# Altium schematic sheet ETHERNET.SchDoc
size A3
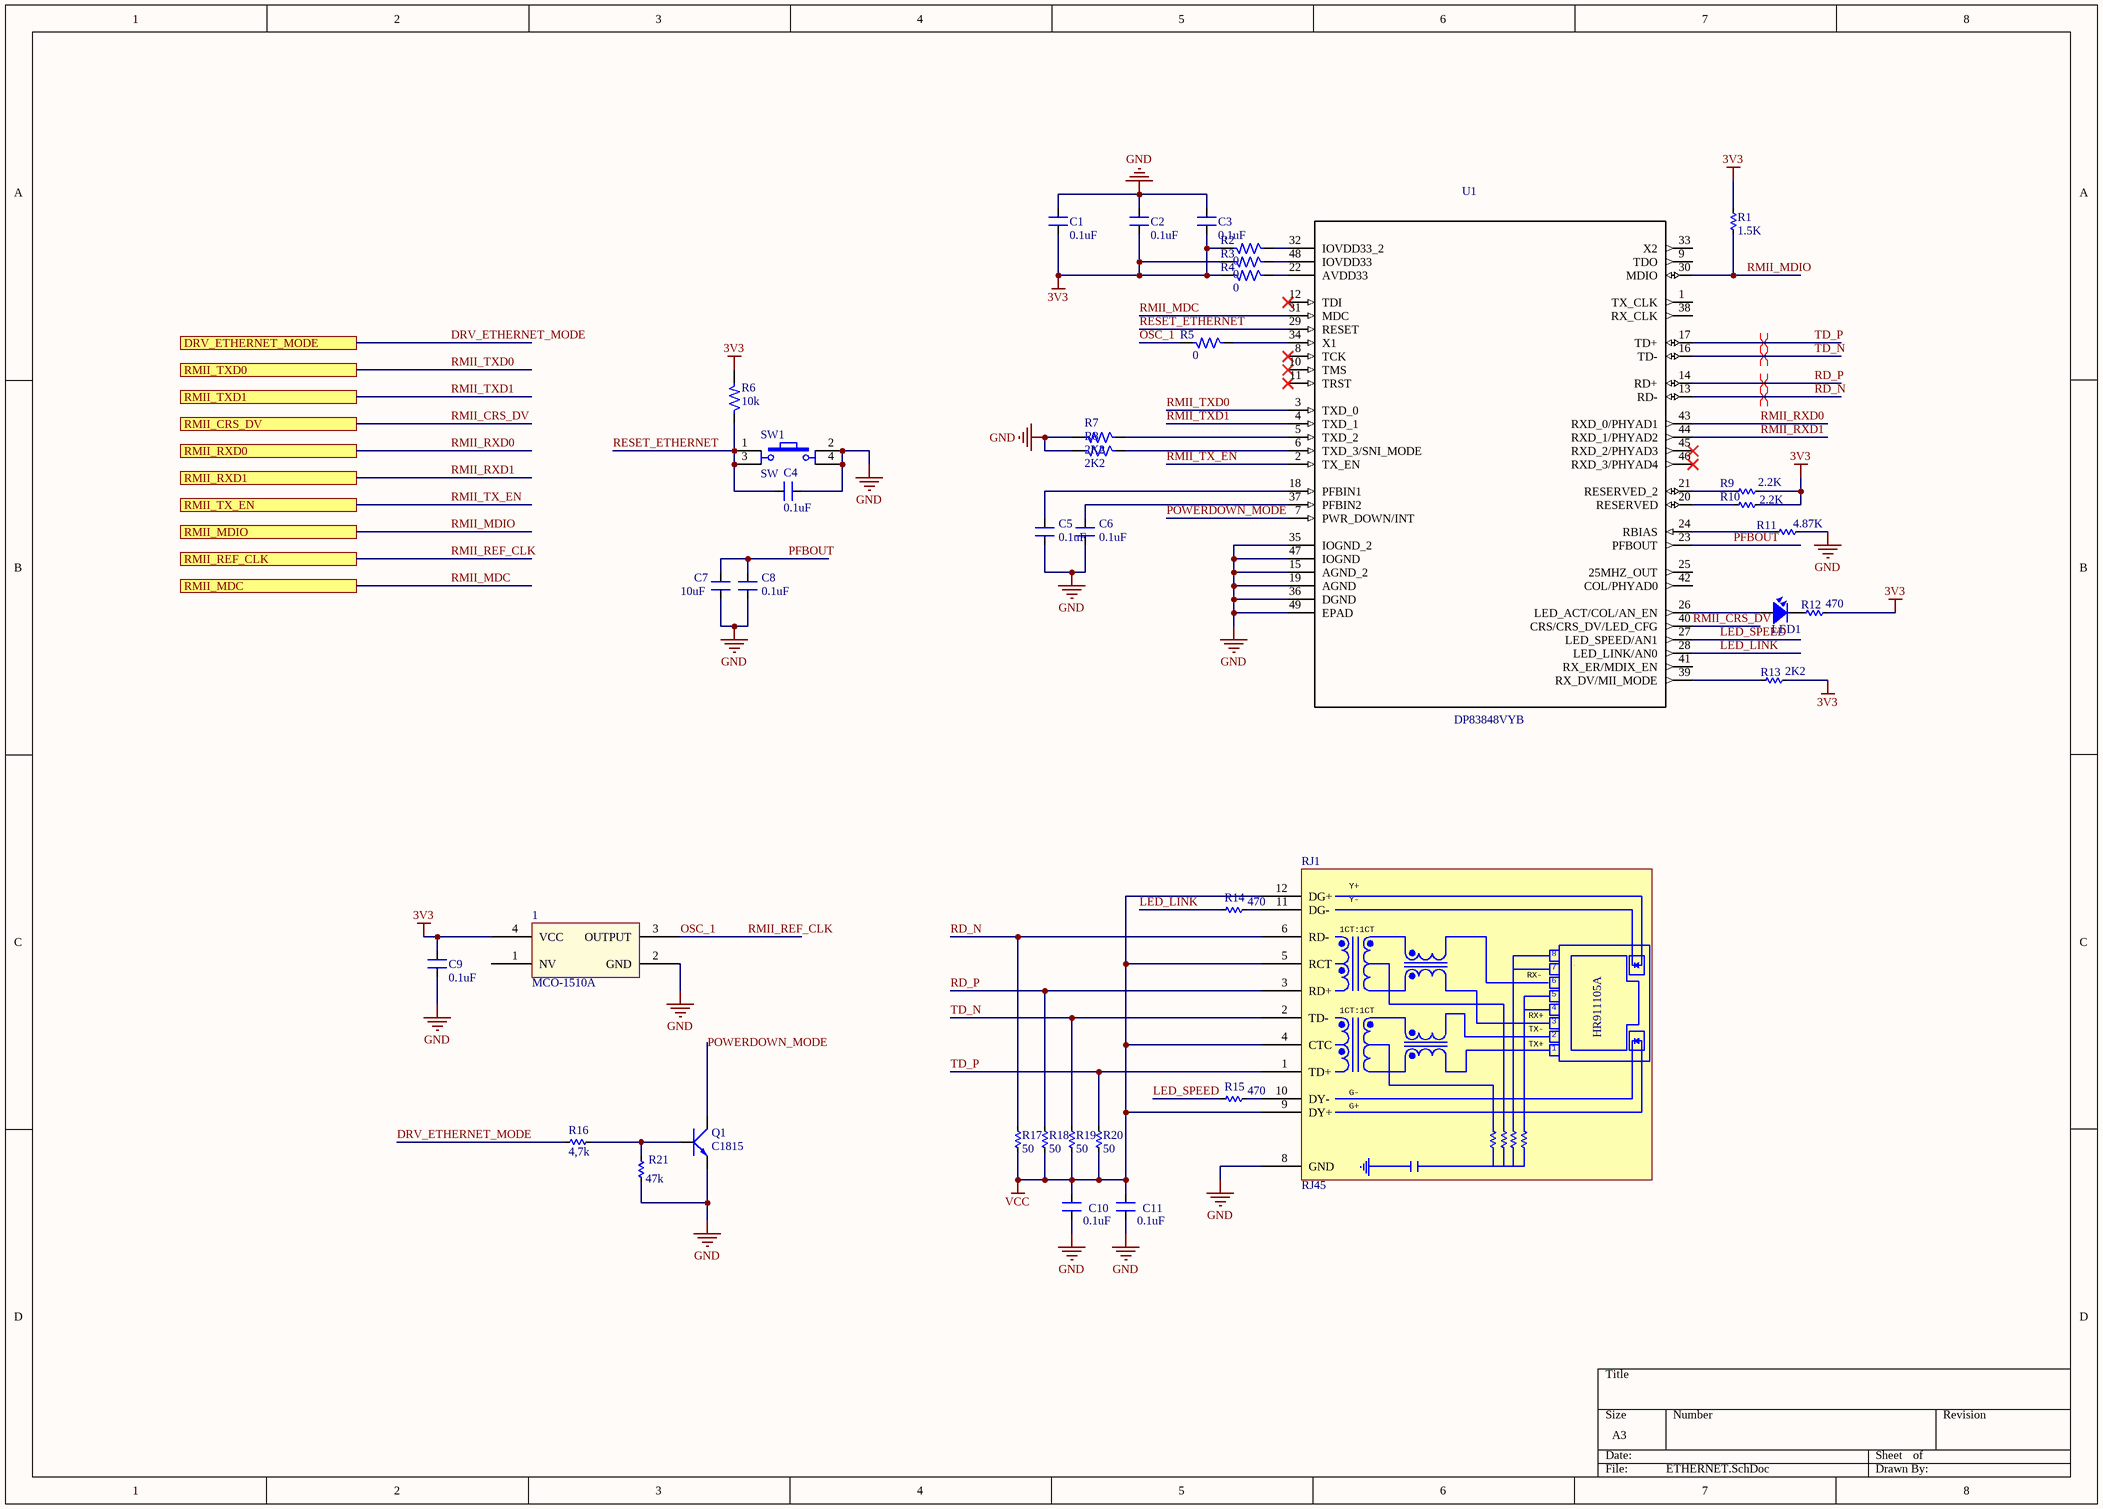
[diagram p0: ETHERNET.SchDoc]

## Parts
1  MCO-1510A  [OSC_1510B]
C1  0.1uF  [res 0805 - duplicate]
C2  0.1uF  [res 0805 - duplicate]
C3  0.1uF  [res 0805 - duplicate]
C4  0.1uF  [res 0805 - duplicate]
C5  0.1uF  [res 0805 - duplicate]
C6  0.1uF  [res 0805 - duplicate]
C7  10uF  [res 0805 - duplicate]
C8  0.1uF  [res 0805 - duplicate]
C9  0.1uF  [res 0805 - duplicate]
C10  0.1uF  [res 0805 - duplicate]
C11  0.1uF  [res 0805 - duplicate]
LED1  LED  [res 0805 - duplicate]  (value not drawn)
Q1  C1815  [SOT23B]
R1  1.5K  [res 0805 - duplicate]
R2  0  [res 0805 - duplicate]
R3  0  [res 0805 - duplicate]
R4  0  [res 0805 - duplicate]
R5  0  [res 0805 - duplicate]
R6  10k  [res 0805 - duplicate]
R7  2K2  [res 0805 - duplicate]
R8  2K2  [res 0805 - duplicate]
R9  2.2K  [res 0805 - duplicate]
R10  2.2K  [res 0805 - duplicate]
R11  4.87K  [res 0805 - duplicate]
R12  470  [res 0805 - duplicate]
R13  2K2  [res 0805 - duplicate]
R14  470  [res 0805 - duplicate]
R15  470  [res 0805 - duplicate]
R16  4,7k  [res 0805 - duplicate]
R17  50  [res 0805 - duplicate]
R18  50  [res 0805 - duplicate]
R19  50  [res 0805 - duplicate]
R20  50  [res 0805 - duplicate]
R21  47k  [res 0805 - duplicate]
RJ1  RJ45  [RJ45 Tranfomer]
SW1  SW  [button]
U1  DP83848VYB  [QFP50P900X900X160-49N]

## Ports
DRV_ETHERNET_MODE, RMII_CRS_DV, RMII_MDC, RMII_MDIO, RMII_REF_CLK, RMII_RXD0, RMII_RXD1, RMII_TX_EN, RMII_TXD0, RMII_TXD1

## Nets
3V3: 1.4(VCC) C1.2 C2.2 C3.2 C9.2 R1.1 R2.2 R3.2 R4.2 R6.2 R9.1 R10.1 R12.1 R13.1
GND: 1.2(GND) C1.1 C2.1 C3.1 C4.2 C5.1 C6.1 C7.1 C8.1 C9.1 C10.1 C11.1 Q1.1(E) R7.2 R8.2 R11.1 R21.1 RJ1.8(GND) SW1.2 SW1.4 U1.15(AGND_2) U1.19(AGND) U1.35(IOGND_2) U1.36(DGND) U1.47(IOGND) U1.49(EPAD)
VCC: C10.2 C11.2 R17.1 R18.1 R19.1 R20.1 RJ1.4(CTC) RJ1.5(RCT) RJ1.9(DY+) RJ1.12(DG+)
DRV_ETHERNET_MODE: R16.1 ; port DRV_ETHERNET_MODE
LED_LINK: R14.1 U1.28(LED_LINK/AN0)
LED_SPEED: R15.1 U1.27(LED_SPEED/AN1)
OSC_1: 1.3(OUTPUT) R5.2 ; port RMII_REF_CLK  [also labelled RMII_REF_CLK]
PFBOUT: C7.2 C8.2 U1.23(PFBOUT)
POWERDOWN_MODE: Q1.2(C) U1.7(PWR_DOWN/INT)
RD_N: R17.2 RJ1.6(RD-) U1.13(RD-)
RD_P: R18.2 RJ1.3(RD+) U1.14(RD+)
RESET_ETHERNET: C4.1 R6.1 SW1.1 SW1.3 U1.29(RESET)
RMII_CRS_DV: U1.40(CRS/CRS_DV/LED_CFG) ; port RMII_CRS_DV
RMII_MDC: U1.31(MDC) ; port RMII_MDC
RMII_MDIO: R1.2 U1.30(MDIO) ; port RMII_MDIO
RMII_RXD0: U1.43(RXD_0/PHYAD1) ; port RMII_RXD0
RMII_RXD1: U1.44(RXD_1/PHYAD2) ; port RMII_RXD1
RMII_TX_EN: U1.2(TX_EN) ; port RMII_TX_EN
RMII_TXD0: U1.3(TXD_0) ; port RMII_TXD0
RMII_TXD1: U1.4(TXD_1) ; port RMII_TXD1
TD_N: R19.2 RJ1.2(TD-) U1.16(TD-)
TD_P: R20.2 RJ1.1(TD+) U1.17(TD+)
NetC5_2: C5.2 U1.18(PFBIN1)
NetC6_2: C6.2 U1.37(PFBIN2)
NetLED1_1: LED1.1 U1.26(LED_ACT/COL/AN_EN)
NetLED1_2: LED1.2 R12.2
NetQ1_3: Q1.3(B) R16.2 R21.2
NetR2_1: R2.1 U1.32(IOVDD33_2)
NetR3_1: R3.1 U1.48(IOVDD33)
NetR4_1: R4.1 U1.22(AVDD33)
NetR5_1: R5.1 U1.34(X1)
NetR7_1: R7.1 U1.5(TXD_2)
NetR8_1: R8.1 U1.6(TXD_3/SNI_MODE)
NetR9_2: R9.2 U1.21(RESERVED_2)
NetR10_2: R10.2 U1.20(RESERVED)
NetR11_2: R11.2 U1.24(RBIAS)
NetR13_2: R13.2 U1.39(RX_DV/MII_MODE)
NetR14_2: R14.2 RJ1.11(DG-)
NetR15_2: R15.2 RJ1.10(DY-)

Not connected (* = marked no-connect by the designer): 1 1(NV); U1 1(TX_CLK) 8(TCK)* 9(TDO) 10(TMS)* 11(TRST)* 12(TDI)* 25(25MHZ_OUT) 33(X2) 38(RX_CLK) 41(RX_ER/MDIX_EN) 42(COL/PHYAD0) 45(RXD_2/PHYAD3)* 46(RXD_3/PHYAD4)*

## Layout directives
differential pair: RD_N, RD_P, TD_N, TD_P

## Notes on the sheet
- (in symbol RJ45 - Tranfomer) Y+; Y-; 1CT:1CT; 7; RX-; RX+; TX-; HR911105A; TX+; G-; G+

## Library data of the parts
1 = OSC50MhZ: WED: http://banlinhkien.vn/goods-3053-osc-50mhz-4-chan-mco-1510a.html
C1-C11 = CM: Cap SMD; Value: 103
LED1 = LED SMD: Value: LED 3 - 5 ly 2 Colour
Q1 = C1815: NPN 600mW, ECB; Value: C1815
R1 R9-R21 = Res-SMD: Resistor; Manufacturer: Generic Components; Class: Passive; Published: 08/06/2000; Publisher: Altium Hobart Technology Centre
R2-R8 = R: Resistor 1/4W; Value: R1/4W - 1K
RJ1 = RJ45 - Tranfomer
SW1 = SW4: Switch button 4 pin; Value: Button chip 4 pin
U1 = DP83848VYB: PHYTER Extended Temperature Single Port 10/100 Mb/s Ethernet Physical Layer Transceiver 48-HLQFP -40 to 105; MF: Texas Instruments; MP: DP83848VYB/NOPB; SnapEDA_Link: https://www.snapeda.com/parts/DP83848VYB/NOPB/Texas%20Instruments/view-part/?ref=snap; Price: 20.53 USD; Availability: Good; Package: LQFP-48 Texas Instruments; Value: *